# EAGLE design si473x_board (EAGLE 9.6.2)
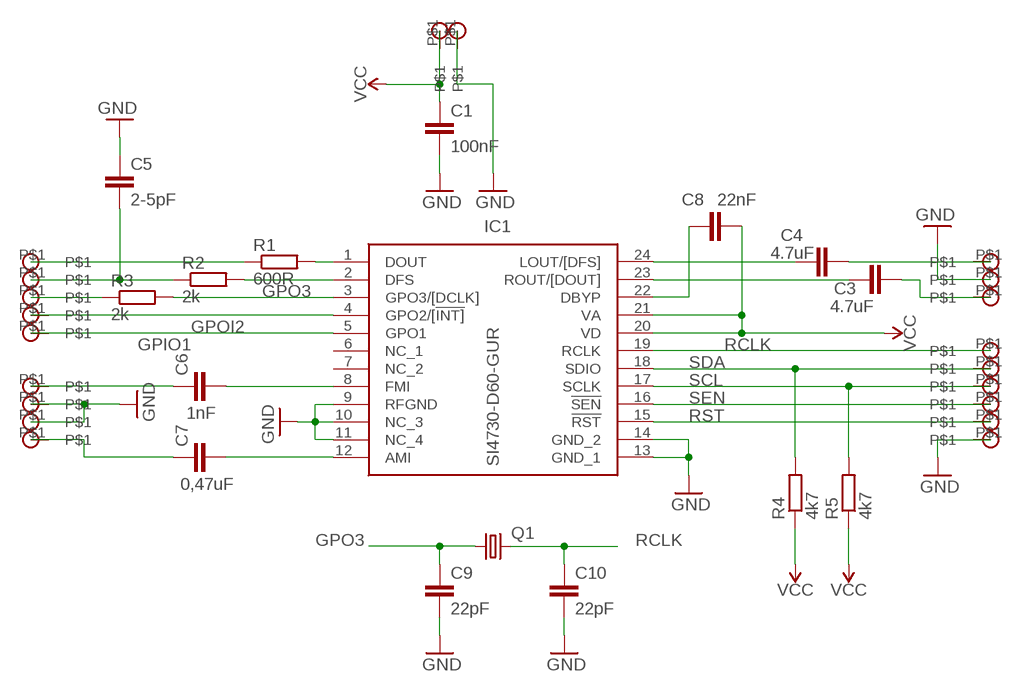
[diagram p0: schematic, sheet 1]

## Parts
AMI  SMD_PIN  [SMD_PIN]
C1  100nF  C-EUC0805  [C0805]
C3  4.7uF  C-EUC1210  [C1210]
C4  4.7uF  C-EUC1210  [C1210]
C5  2-5pF  C-EUC0805  [C0805]
C6  1nF  C-EUC0805  [C0805]
C7  0,47uF  C-EUC0805  [C0805]
C8  22nF  C-EUC0805  [C0805]
C9  22pF  C-EUC0805  [C0805]
C10  22pF  C-EUC0805  [C0805]
FMI  SMD_PIN  [SMD_PIN]
GND  SMD_PIN  [SMD_PIN]
IC1  SI4730-D60-GUR  [SOP64P600X200-24N]
Q1  KX-327-NHF  [3.2X1.5]
R1  600R  R-EU_R0805  [R0805]
R2  2k  R-EU_R0805  [R0805]
R3  2k  R-EU_R0805  [R0805]
R4  4k7  R-EU_0204/7  [0204/7]
R5  4k7  R-EU_0204/7  [0204/7]
U$1  SMD_PIN  [SMD_PIN]
U$2  SMD_PIN  [SMD_PIN]
U$3  SMD_PIN  [SMD_PIN]
U$4  SMD_PIN  [SMD_PIN]
U$5  SMD_PIN  [SMD_PIN]
U$8  SMD_PIN  [SMD_PIN]
U$10  SMD_PIN  [SMD_PIN]
U$11  SMD_PIN  [SMD_PIN]
U$12  SMD_PIN  [SMD_PIN]
U$13  SMD_PIN  [SMD_PIN]
U$14  SMD_PIN  [SMD_PIN]
U$15  SMD_PIN  [SMD_PIN]
U$16  SMD_PIN  [SMD_PIN]
U$17  SMD_PIN  [SMD_PIN]
U$18  SMD_PIN  [SMD_PIN]
U$19  SMD_PIN  [SMD_PIN]
U$20  SMD_PIN  [SMD_PIN]

## Nets
GND: C1.2 C5.1 C9.2 C10.2 GND.P$1 IC1.9(RFGND) IC1.10(NC_3) IC1.11(NC_4) IC1.13(GND_1) IC1.14(GND_2) U$8.P$1 U$11.P$1 U$13.P$1 U$20.P$1
GPIO1: IC1.5(GPO1) U$5.P$1
GPO3: C9.1 IC1.3(GPO3/[DCLK]) Q1.1 R3.2
GPOI2: IC1.4(GPO2/[!INT]) U$4.P$1
N$1: IC1.1(DOUT) R1.2
N$2: IC1.2(DFS) R2.2
N$4: R1.1 U$1.P$1
N$5: C5.2 R2.1 U$2.P$1
N$6: R3.1 U$3.P$1
N$14: C3.1 IC1.23(ROUT/[DOUT])
N$15: C3.2 U$14.P$1
N$16: C4.1 IC1.24(LOUT/[DFS])
N$17: C4.2 U$12.P$1
N$18: C8.2 IC1.22(DBYP)
N$19: C6.1 FMI.P$1
N$20: C6.2 IC1.8(FMI)
N$21: C7.2 IC1.12(AMI)
N$22: AMI.P$1 C7.1
RCLK: C10.1 IC1.19(RCLK) Q1.2 U$15.P$1
RST: IC1.15(!RST) U$19.P$1
SCL: IC1.17(SCLK) R5.2 U$17.P$1
SDA: IC1.18(SDIO) R4.2 U$16.P$1
SEN: IC1.16(!SEN) U$18.P$1
VCC: C1.1 C8.1 IC1.20(VD) IC1.21(VA) R4.1 R5.1 U$10.P$1
Unconnected: IC1.6(NC_1) IC1.7(NC_2)

## Library data of the parts
AMI FMI GND U$1-U$5 U$8 U$10-U$20 = mylib:SMD_PIN
C1 C3-C10 = rcl:C-EU: CAPACITOR, European symbol; SPICEPREFIX: C
IC1 = SI4730-D60-GUR:SI4730-D60-GUR: RF Receiver AM/FM/LW/SW 3.3V/5V Automotive 24-Pin SSOP T/R Source: Datasheet <https://www.silabs.com/documents/public/data-sheets/Si4730-31-34-35-D60.pdf>; ARROW_PART_NUMBER: SI4730-D60-GUR; ARROW_PRICE-STOCK: https://www.arrow.com/en/products/si4730-d60-gur/silicon-labs; DESCRIPTION: RF Receiver AM/FM/LW/SW 3.3V/5V Automotive 24-Pin SSOP T/R; HEIGHT: 2mm; MANUFACTURER_NAME: Silicon Labs; MANUFACTURER_PART_NUMBER: SI4730-D60-GUR; MOUSER_PART_NUMBER: N/A; MOUSER_PRICE-STOCK: https://www.mouser.com/Search/Refine.aspx?Keyword=N%2FA
Q1 = crystal-geyer_V1_0:KX-327: Tuning Fork Crystals (kHz) SMD: KX327 - Serie Model Size l/w/h [mm] Frequency Range Frequency Stability Temp. Range [°C] Load Capacitance AECQ 200 availabel Datasheet KX-327VT KX-327FT KX-327RT KX-327NHT KX-327NHF KX-327L KX-327S 1.25/1.05/0.5 1.6/1.0/0.5 2.0/1.2/0.6 3.2/1.5/0.8 3.2/1.5/0.8 7.0/1.5/1.4 8.2/3.8/2.5 32,768 kHz 32,768 kHz 32,768 kHz 32,768 kHz 32,768 kHz 32,768 kHz 32,768 kHz ±10 … ±20ppm ±10 … ±20ppm ±10 … ±20ppm ±10 … ±20ppm ±10 … ±20ppm ±10 … ±20ppm ±5 … ±20ppm (*) -40°C …+85°C (*) -40°C …+85°C (*) -40°C …+85°C (*) -40°C …+85°C (*) -40°C …+125°C (*) -40°C …+85°C (*) -40°C …+85°C 7/9/12,5 7/9/12,5 7/9/12,6 7/9/12,5 9/12,5 7/9/12,5 6/12,5 - - - - yes - - KX-327VT.pdf <http://www.geyer-electronic.de/uploads/tx_userartikelfrequenz/GEYER-KX-327VT.pdf> KX-327FT.pdf <http://www.geyer-electronic.de/uploads/tx_userartikelfrequenz/GEYER-KX-327FT.pdf> KX-327RT.pdf <http://www.geyer-electronic.de/uploads/tx_userartikelfrequenz/GEYER-KX-327RT.pdf> KX-327NHT.pdf <http://www.geyer-electronic.de/uploads/tx_userartikelfrequenz/GEYER-KX-327NHT.pdf> KX-327NHF.pdf <http://www.geyer-electronic.de/uploads/tx_userartikelfrequenz/GEYER-KX-327NHF.pdf> KX-327L.pdf <http://www.geyer-electronic.de/uploads/tx_userartikelfrequenz/GEYER-KX-327L.pdf> KX-327S.pdf <http://www.geyer-electronic.de/uploads/tx_userartikelfrequenz/GEYER-KX-327S.pdf> <http://www.geyer-electronic.de/fileadmin/template/img/logo-geyer-electronic.png> Details see: http://www.geyer-electronic.de/Frequenz-Produkte.9.0.html Created 2016-06-07, Hans Locher 2016 (C) Geyer Quartz Technology KX327VT,KX327FT,KX327RT,KX327NHT,KX327NHF,KX327S,KX327L;125105;1610;2012;3215;7015;8238;1,25x1,05,1.25x1.05;1,6x1,0,1.6x1.0;2,0x1,2,2.0x1.2;3,2x1,5,3.2x1.5;8,2x3,8,8.2x3.8,7.0x1.5,7,0x1,532.768kHz
R1-R5 = rcl:R-EU_: RESISTOR, European symbol; SPICEPREFIX: R

## Board
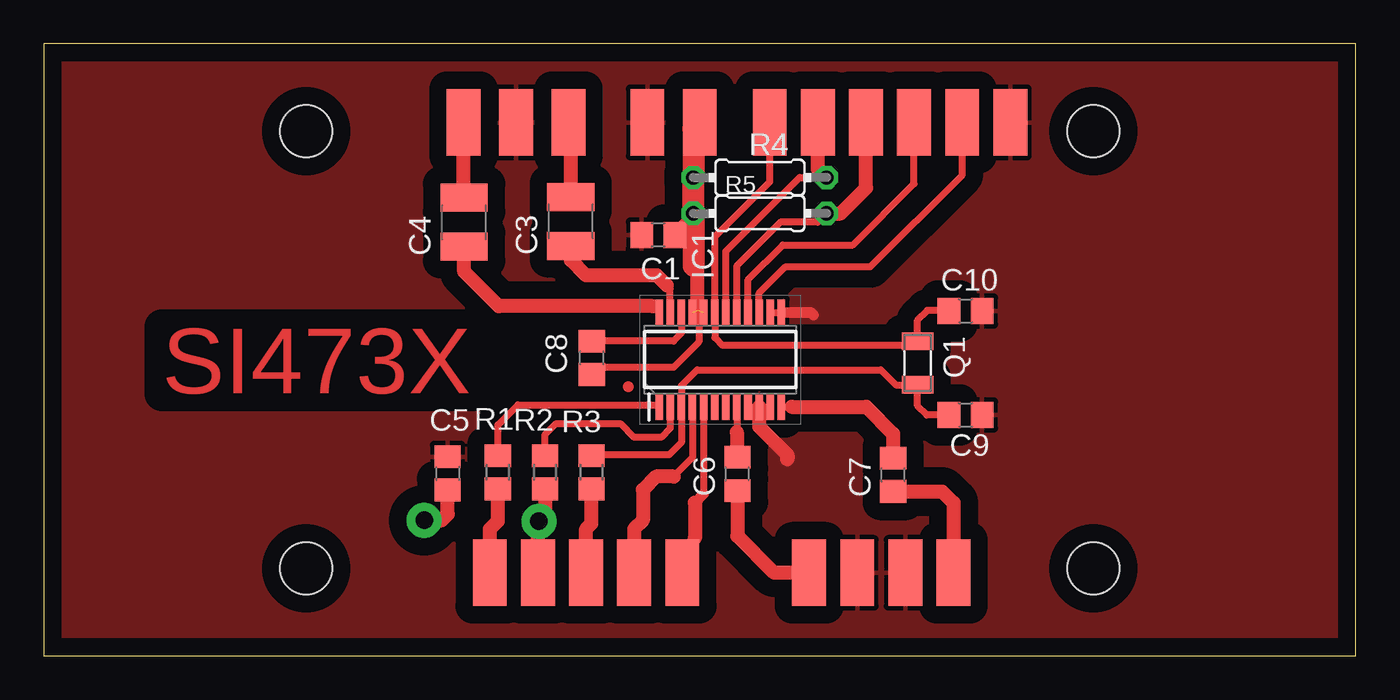
[diagram p1: board, top side]
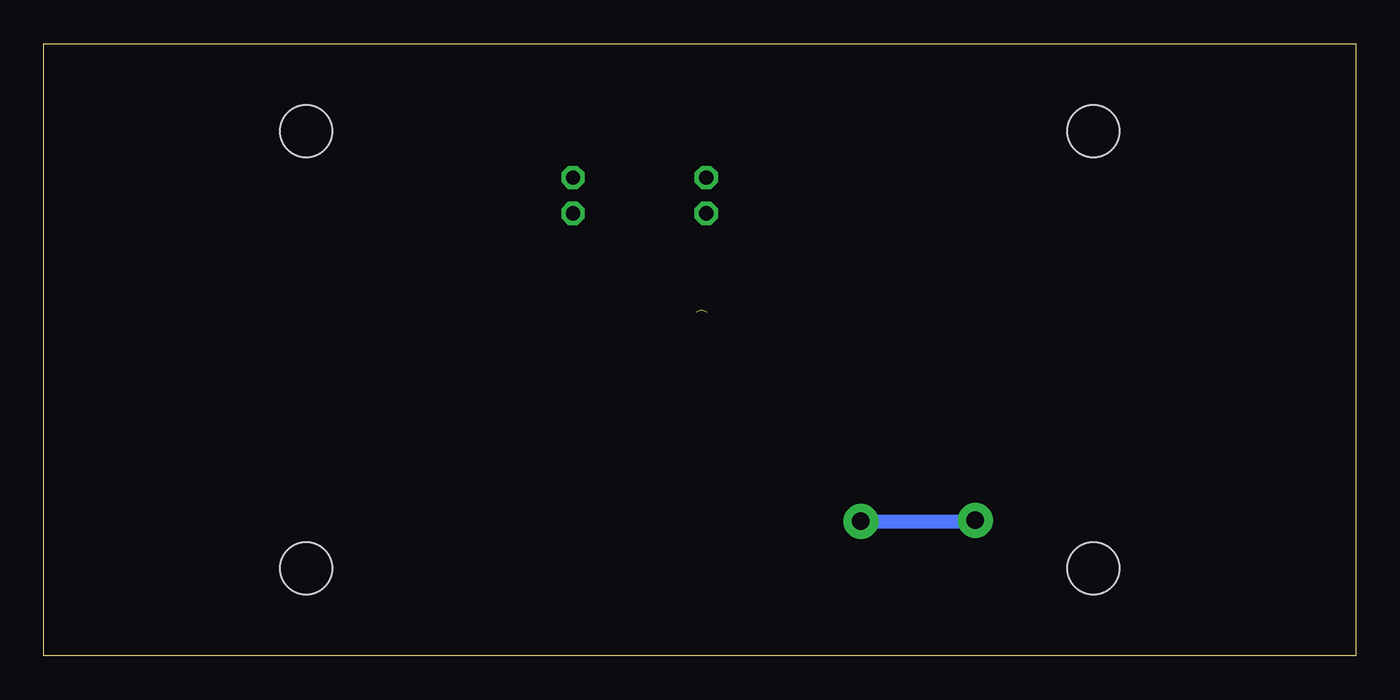
[diagram p2: board, bottom side, seen from below]

Size 75 x 35 mm. Coordinates in mm from the lower left corner, seen from the top.
Outline: 0,0 75,0 75,35 0,35 0,0
Copper layers (1*16): Top 0.035mm / dielectric 1.5mm / Bottom 0.035mm
Design rules "default": minimum track width 6mil, minimum drill 0.35mm, track to track 6mil, track to pad 6mil, pad to pad 6mil, via to via 6mil, smd to smd 6mil, copper to edge 40mil, drill to drill 6mil, minimum pad ring 10mil, minimum via ring 8mil, stop-mask expansion 4mil, vias tented up to drill 0mil, thermal gap 10mil
Holes 3 mm at 15,5 60,5 15,30 60,30

### Footprints (pad centres in the part's own frame; a part is rotated, then mirrored left to right if it is on the bottom)
SMD_PIN = smd 1.93 x 3.81: P$1 0,0
C0805 = smd 1.3 x 1.5: 1 -0.95,0; 2 0.95,0
C1210 = smd 1.6 x 2.7: 1 -1.4,0; 2 1.4,0
SOP64P600X200-24N = smd 1.5 x 0.435: 1 -2.7,3.492; 2 -2.7,2.858; 3 -2.7,2.222; 4 -2.7,1.588; 5 -2.7,0.952; 6 -2.7,0.318; 7 -2.7,-0.318; 8 -2.7,-0.952; 9 -2.7,-1.588; 10 -2.7,-2.222; 11 -2.7,-2.858; 12 -2.7,-3.492; 13 2.7,-3.492; 14 2.7,-2.858; 15 2.7,-2.222; 16 2.7,-1.588; 17 2.7,-0.952; 18 2.7,-0.318; 19 2.7,0.318; 20 2.7,0.952; 21 2.7,1.588; 22 2.7,2.222; 23 2.7,2.858; 24 2.7,3.492
3.2X1.5 = smd 1 x 1.8: 1 -1.25,0; 2 1.25,0
R0805 = smd 1.3 x 1.5: 1 -0.95,0; 2 0.95,0
0204/7 = drill 0.813 octagon: 1 -3.81,0; 2 3.81,0

### Placement (x,y rotation side)
AMI  52,4.75 0 top
C1  35.13,24.06 180 top
C3  30.13,24.84 90 top
C4  24.03,24.79 90 top
C5  23.09,10.43 270 top
C6  39.65,10.4 90 top
C7  48.55,10.35 90 top
C8  31.33,17.04 90 top
C9  52.69,13.77 0 top
C10  52.69,19.72 0 top
FMI  43.75,4.75 0 top
GND  46.5,4.75 0 top
IC1  38.67,16.93 90 top
Q1  49.95,16.75 90 top
R1  25.96,10.5 90 top
R2  28.66,10.5 90 top
R3  31.31,10.5 90 top
R4  40.94,27.35 0 top
R5  40.94,25.3 0 top
U$1  25.5,4.75 0 top
U$2  28.25,4.75 0 top
U$3  31,4.75 0 top
U$4  33.75,4.75 0 top
U$5  36.5,4.75 0 top
U$8  49.25,4.75 0 top
U$10  37.5,30.5 0 top
U$11  34.5,30.5 0 top
U$12  24,30.5 0 top
U$13  27,30.5 0 top
U$14  30,30.5 0 top
U$15  41.5,30.5 0 top
U$16  44.25,30.5 0 top
U$17  47,30.5 0 top
U$18  49.75,30.5 0 top
U$19  52.5,30.5 0 top
U$20  55.25,30.5 0 top

### Tracks (layer width: path | path; a pad name or v marks a point on that pad's centre or on a via)
GND
  Top 0.406: IC1.9 IC1.10 IC1.11 | IC1.14 IC1.13
  Top 0.61: IC1.13 43.87,19.63 44,19.5
  Top 0.813: IC1.10 40.89,13.11 42.5,11.5 42.5,11.25
  pour Top (isolate 1): -2,36.5 -2,-2 77,-2 77,36.5
GPIO1
  Top 0.406: IC1.5 37.72,9.25
  Top 0.61: 37.22,6.72 36.5,6 U$5.P$1 | 37.22,8.75 37.72,9.25
  Top 0.813: 37.22,8.75 37.22,6.72
GPO3
  Top 0.406: C9.1 50.48,13.77 49.95,14.3 Q1.1 48.7,15.5 47.85,16.35 37.35,16.35 36.45,15.45 IC1.3 36.45,12.2 35.75,11.5 31.36,11.5 R3.2
GPOI2
  Top 0.406: IC1.4 37.08,11.33 36,10.25
  Top 0.813: 36,10.25 35,10.25 34.25,9.5 34.25,7.75 33.75,7.25 U$4.P$1
N$1
  Top 0.406: R1.2 25.96,13.21 27.1,14.35 35.18,14.35 IC1.1
N$2
  Top 0.406: IC1.2 35.81,13.01 35.3,12.5 33.75,12.5 33,13.25 29.25,13.25 28.66,12.66 R2.2
N$4
  Top 0.813: U$1.P$1 25.5,7.25 25.96,7.71 R1.1
N$5  (via drill 1 pad 2)
  Top 0.813: v21.75,7.75 22.75,7.75 23.09,8.09 C5.2 | U$2.P$1 28.25,7.65 v28.3,7.7 28.66,8.06 R2.1
  Bottom 0.813: v28.3,7.7 21.8,7.7 v21.75,7.75
N$6
  Top 0.813: U$3.P$1 31,7.25 31.31,7.56 R3.1
N$14
  Top 0.406: IC1.23 35.81,20.99 35.6,21.2
  Top 0.813: 35.6,21.2 35.05,21.75 31,21.75 30.13,22.62 C3.1
N$15
  Top 0.813: C3.2 30.13,30.37 U$14.P$1
N$16
  Top 0.406: 24.11,23.39 C4.1 | IC1.24 34.81,20
  Top 0.813: 34.81,20 26,20 24.03,21.97 C4.1
N$17
  Top 0.813: C4.2 24,26.22 U$12.P$1
N$18
  Top 0.406: IC1.22 36.45,18.45 36,18 C8.2
N$19
  Top 0.813: C6.1 39.65,6.85 41.75,4.75 FMI.P$1
N$20
  Top 0.406: IC1.8 39.62,12.78
  Top 0.813: 39.62,12.78 39.62,11.38 C6.2
N$21
  Top 0.406: IC1.12 42.75,14.23
  Top 0.813: C7.2 48.55,12.7 47.02,14.23 42.75,14.23
N$22
  Top 0.813: C7.1 51.35,9.4 52,8.75 AMI.P$1
RCLK
  Top 0.406: C10.1 51.71,19.75 50.5,19.75 49.95,19.2 Q1.2 49.7,17.75 38.81,17.75 38.36,18.2 IC1.19 38.35,23.95 41.5,27.1 U$15.P$1
RST
  Top 0.406: IC1.15 40.89,20.74 42.4,22.25 47.25,22.25 52.5,27.5 U$19.P$1
SCL
  Top 0.406: IC1.17 39.63,19.64 39.63,22.33 42.11,24.8 44.25,24.8 R5.2
  Top 0.813: R5.2 45.55,25.3 47,26.75 U$17.P$1
SDA
  Top 0.406: IC1.18 38.99,23.14 43.2,27.35 R4.2
  Top 0.813: R4.2 44.25,27.85 U$16.P$1
SEN
  Top 0.406: IC1.16 40.26,21.51 42.25,23.5 46.25,23.5 49.75,27 U$18.P$1
VCC  (2 unrouted)
  Top 0.406: C8.1 31.74,16.5 36,16.5 37.45,17.95 37.45,19.5 37.45,19.63 37.25,19.63 37.4,19.78
  Top 0.813: 37.13,25.11 37.15,25.13 | C1.1 37.13,25.11 | 37.13,25.11 R5.1 | 37.13,30.13 U$10.P$1 | 37.45,19.5 37.35,19.6 37.35,22.1 37.15,22.3
  Top 1.27: R5.1 R4.1 37.13,30.13 | 37.15,25.13 37.15,22.3
(copper drawn outside any net)
  shapes: Top circle x1

### Text on the board
Top: SI473X